# EAGLE schematic micr0x (EAGLE 9.2.2)

## Sheet 1 of 2
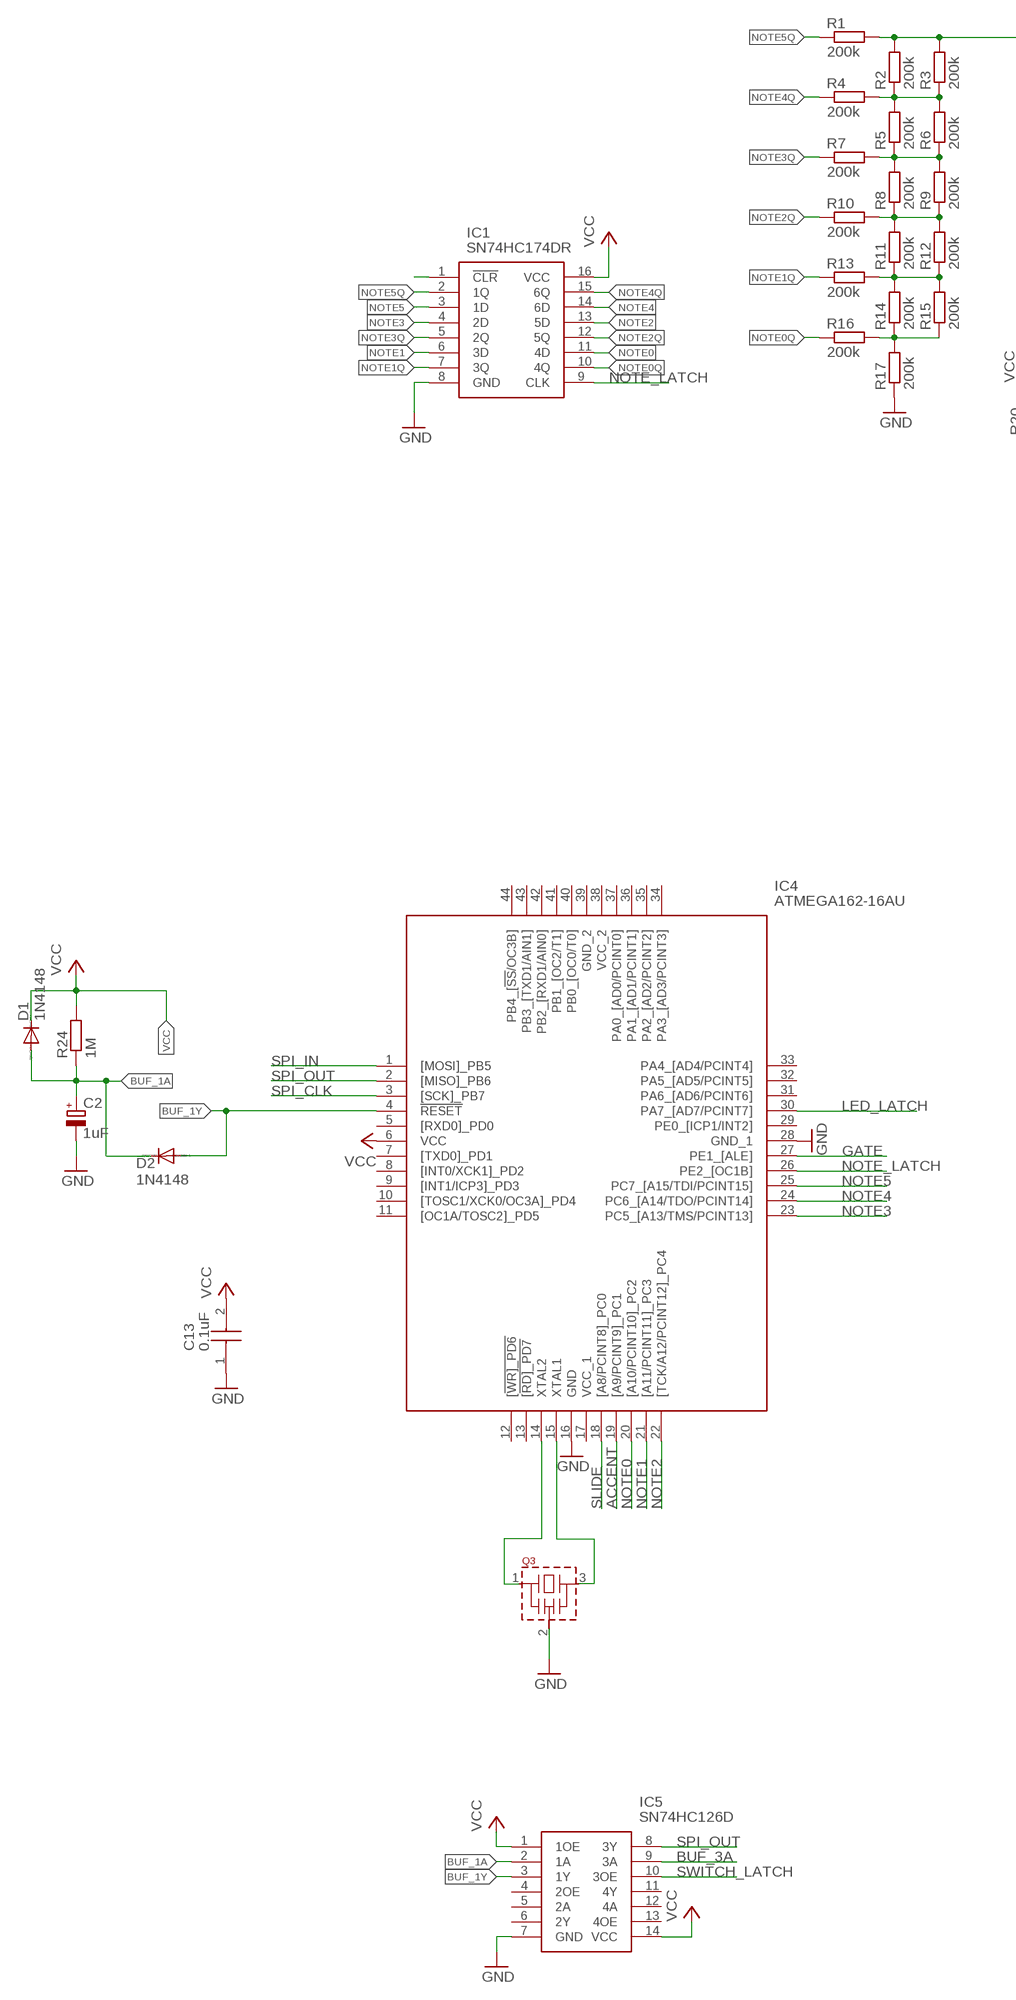
[diagram p0: schematic, sheet 1, part 1 of 2]
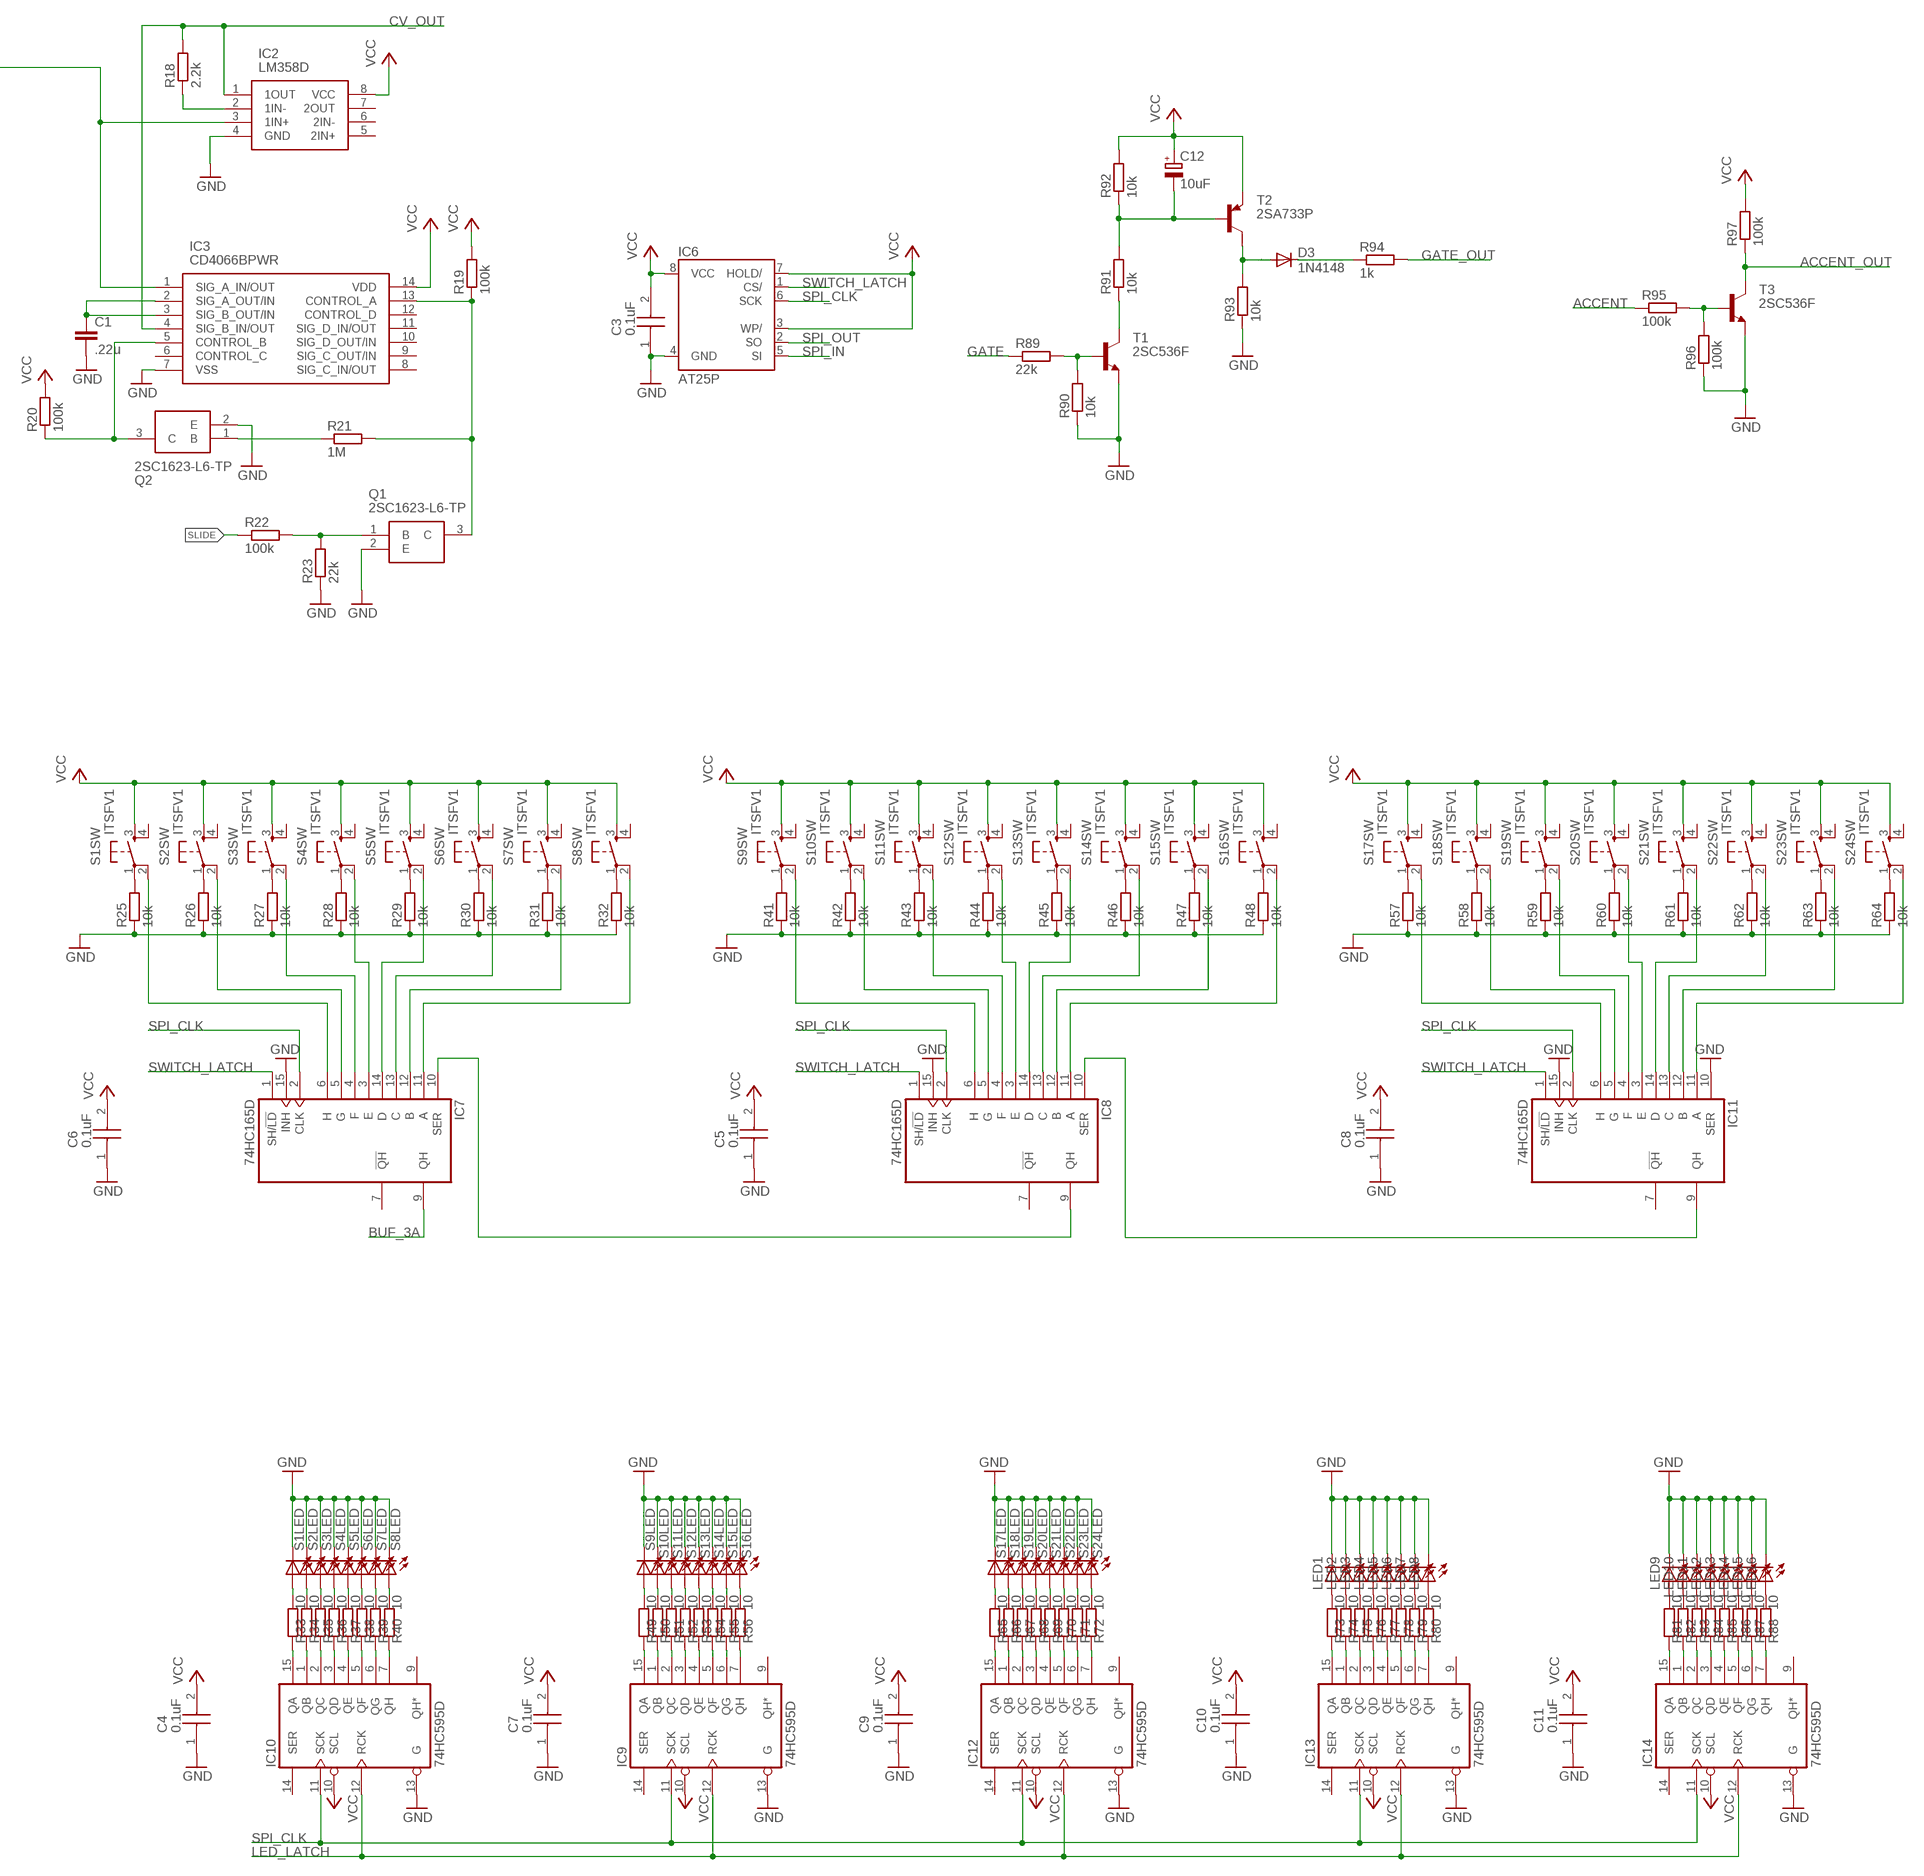
[diagram p1: schematic, sheet 1, part 2 of 2]

### Parts
C1  .22u  C-EU075-032X103  [C075-032X103]
C2  1uF  CPOL-EUE2-5  [E2-5]
C3  0.1uF  GCJ188R71H104KA12D  [CAPC1608X90N]
C4  0.1uF  GCJ188R71H104KA12D  [CAPC1608X90N]
C5  0.1uF  GCJ188R71H104KA12D  [CAPC1608X90N]
C6  0.1uF  GCJ188R71H104KA12D  [CAPC1608X90N]
C7  0.1uF  GCJ188R71H104KA12D  [CAPC1608X90N]
C8  0.1uF  GCJ188R71H104KA12D  [CAPC1608X90N]
C9  0.1uF  GCJ188R71H104KA12D  [CAPC1608X90N]
C10  0.1uF  GCJ188R71H104KA12D  [CAPC1608X90N]
C11  0.1uF  GCJ188R71H104KA12D  [CAPC1608X90N]
C12  10uF  CPOL-EUE2-5  [E2-5]
C13  0.1uF  GCJ188R71H104KA12D  [CAPC1608X90N]
D1  1N4148  1N4148DO35-7  [DO35-7]
D2  1N4148  1N4148DO35-7  [DO35-7]
D3  1N4148  1N4148DO35-7  [DO35-7]
IC1  SN74HC174DR  [SOIC127P600X175-16N]
IC2  LM358D  [SOIC127P600X175-8N]
IC3  CD4066BPWR  [SOP65P640X120-14N]
IC4  ATMEGA162-16AU  [QFP80P1200X1200X120-44N]
IC5  SN74HC126D  [SOIC127P600X175-14N]
IC6  AT25P  [DIL08]
IC7  74HC165D  [SO16]
IC8  74HC165D  [SO16]
IC9  74HC595D  [SO16]
IC10  74HC595D  [SO16]
IC11  74HC165D  [SO16]
IC12  74HC595D  [SO16]
IC13  74HC595D  [SO16]
IC14  74HC595D  [SO16]
LED1  LED3MM  [LED3MM]
LED2  LED3MM  [LED3MM]
LED3  LED3MM  [LED3MM]
LED4  LED3MM  [LED3MM]
LED5  LED3MM  [LED3MM]
LED6  LED3MM  [LED3MM]
LED7  LED3MM  [LED3MM]
LED8  LED3MM  [LED3MM]
LED9  LED3MM  [LED3MM]
LED10  LED3MM  [LED3MM]
LED11  LED3MM  [LED3MM]
LED12  LED3MM  [LED3MM]
LED13  LED3MM  [LED3MM]
LED14  LED3MM  [LED3MM]
LED15  LED3MM  [LED3MM]
LED16  LED3MM  [LED3MM]
Q1  2SC1623-L6-TP  [SOT96P237X112-3N]
Q2  2SC1623-L6-TP  [SOT96P237X112-3N]
Q3  CSTLS_X  [CSTLS_X]
R1  200k  R-EU_R0603  [R0603]
R2  200k  R-EU_R0603  [R0603]
R3  200k  R-EU_R0603  [R0603]
R4  200k  R-EU_R0603  [R0603]
R5  200k  R-EU_R0603  [R0603]
R6  200k  R-EU_R0603  [R0603]
R7  200k  R-EU_R0603  [R0603]
R8  200k  R-EU_R0603  [R0603]
R9  200k  R-EU_R0603  [R0603]
R10  200k  R-EU_R0603  [R0603]
R11  200k  R-EU_R0603  [R0603]
R12  200k  R-EU_R0603  [R0603]
R13  200k  R-EU_R0603  [R0603]
R14  200k  R-EU_R0603  [R0603]
R15  200k  R-EU_R0603  [R0603]
R16  200k  R-EU_R0603  [R0603]
R17  200k  R-EU_R0603  [R0603]
R18  2.2k  R-EU_R0603  [R0603]
R19  100k  R-EU_R0603  [R0603]
R20  100k  R-EU_R0603  [R0603]
R21  1M  R-EU_R0603  [R0603]
R22  100k  R-EU_R0603  [R0603]
R23  22k  R-EU_R0603  [R0603]
R24  1M  R-EU_R0603  [R0603]
R25  10k  R-EU_R0603  [R0603]
R26  10k  R-EU_R0603  [R0603]
R27  10k  R-EU_R0603  [R0603]
R28  10k  R-EU_R0603  [R0603]
R29  10k  R-EU_R0603  [R0603]
R30  10k  R-EU_R0603  [R0603]
R31  10k  R-EU_R0603  [R0603]
R32  10k  R-EU_R0603  [R0603]
R33  10  R-EU_R0603  [R0603]
R34  10  R-EU_R0603  [R0603]
R35  10  R-EU_R0603  [R0603]
R36  10  R-EU_R0603  [R0603]
R37  10  R-EU_R0603  [R0603]
R38  10  R-EU_R0603  [R0603]
R39  10  R-EU_R0603  [R0603]
R40  10  R-EU_R0603  [R0603]
R41  10k  R-EU_R0603  [R0603]
R42  10k  R-EU_R0603  [R0603]
R43  10k  R-EU_R0603  [R0603]
R44  10k  R-EU_R0603  [R0603]
R45  10k  R-EU_R0603  [R0603]
R46  10k  R-EU_R0603  [R0603]
R47  10k  R-EU_R0603  [R0603]
R48  10k  R-EU_R0603  [R0603]
R49  10  R-EU_R0603  [R0603]
R50  10  R-EU_R0603  [R0603]
R51  10  R-EU_R0603  [R0603]
R52  10  R-EU_R0603  [R0603]
R53  10  R-EU_R0603  [R0603]
R54  10  R-EU_R0603  [R0603]
R55  10  R-EU_R0603  [R0603]
R56  10  R-EU_R0603  [R0603]
R57  10k  R-EU_R0603  [R0603]
R58  10k  R-EU_R0603  [R0603]
R59  10k  R-EU_R0603  [R0603]
R60  10k  R-EU_R0603  [R0603]
R61  10k  R-EU_R0603  [R0603]
R62  10k  R-EU_R0603  [R0603]
R63  10k  R-EU_R0603  [R0603]
R64  10k  R-EU_R0603  [R0603]
R65  10  R-EU_R0603  [R0603]
R66  10  R-EU_R0603  [R0603]
R67  10  R-EU_R0603  [R0603]
R68  10  R-EU_R0603  [R0603]
R69  10  R-EU_R0603  [R0603]
R70  10  R-EU_R0603  [R0603]
R71  10  R-EU_R0603  [R0603]
R72  10  R-EU_R0603  [R0603]
R73  10  R-EU_R0603  [R0603]
R74  10  R-EU_R0603  [R0603]
R75  10  R-EU_R0603  [R0603]
R76  10  R-EU_R0603  [R0603]
R77  10  R-EU_R0603  [R0603]
R78  10  R-EU_R0603  [R0603]
R79  10  R-EU_R0603  [R0603]
R80  10  R-EU_R0603  [R0603]
R81  10  R-EU_R0603  [R0603]
R82  10  R-EU_R0603  [R0603]
R83  10  R-EU_R0603  [R0603]
R84  10  R-EU_R0603  [R0603]
R85  10  R-EU_R0603  [R0603]
R86  10  R-EU_R0603  [R0603]
R87  10  R-EU_R0603  [R0603]
R88  10  R-EU_R0603  [R0603]
R89  22k  R-EU_R0603  [R0603]
R90  10k  R-EU_R0603  [R0603]
R91  10k  R-EU_R0603  [R0603]
R92  10k  R-EU_R0603  [R0603]
R93  10k  R-EU_R0603  [R0603]
R94  1k  R-EU_R0603  [R0603]
R95  100k  R-EU_R0603  [R0603]
R96  100k  R-EU_R0603  [R0603]
R97  100k  R-EU_R0603  [R0603]
S1  ITSFV1  [ITSFV1]
S2  ITSFV1  [ITSFV1]
S3  ITSFV1  [ITSFV1]
S4  ITSFV1  [ITSFV1]
S5  ITSFV1  [ITSFV1]
S6  ITSFV1  [ITSFV1]
S7  ITSFV1  [ITSFV1]
S8  ITSFV1  [ITSFV1]
S9  ITSFV1  [ITSFV1]
S10  ITSFV1  [ITSFV1]
S11  ITSFV1  [ITSFV1]
S12  ITSFV1  [ITSFV1]
S13  ITSFV1  [ITSFV1]
S14  ITSFV1  [ITSFV1]
S15  ITSFV1  [ITSFV1]
S16  ITSFV1  [ITSFV1]
S17  ITSFV1  [ITSFV1]
S18  ITSFV1  [ITSFV1]
S19  ITSFV1  [ITSFV1]
S20  ITSFV1  [ITSFV1]
S21  ITSFV1  [ITSFV1]
S22  ITSFV1  [ITSFV1]
S23  ITSFV1  [ITSFV1]
S24  ITSFV1  [ITSFV1]
T1  2SC536F  -NPN-TO92  [TO92]
T2  2SA733P  -PNP-TO92  [TO92]
T3  2SC536F  -NPN-TO92  [TO92]

### Nets
ACCENT: IC4.19([A9/PCINT9]_PC1) R95.1
ACCENT_OUT: R97.1 T3.3(C)
BUF_1A: C2.+ D1.A D2.C IC5.2(1A) R24.1
BUF_1Y: D2.A IC4.4(!RESET) IC5.3(1Y)
BUF_3A: IC5.9(3A) IC7.9(QH)
CV_OUT: IC2.1(1OUT) IC3.4(SIG_B_IN/OUT) R18.2
GATE: IC4.27(PE1_[ALE]) R89.1
GATE_OUT: R94.2
GND: C1.2 C2.- C3.1 C4.1 C5.1 C6.1 C7.1 C8.1 C9.1 C10.1 C11.1 C13.1 IC1.8(GND) IC2.4(GND) IC3.7(VSS) IC4.16(GND) IC4.28(GND_1) IC5.7(GND) IC6.4(GND) IC7.15(INH) IC8.15(INH) IC9.13(G) IC10.13(G) IC11.10(SER) IC11.15(INH) IC12.13(G) IC13.13(G) IC14.13(G) LED1.K(C) LED2.K(C) LED3.K(C) LED4.K(C) LED5.K(C) LED6.K(C) LED7.K(C) LED8.K(C) LED9.K(C) LED10.K(C) LED11.K(C) LED12.K(C) LED13.K(C) LED14.K(C) LED15.K(C) LED16.K(C) Q1.2(E) Q2.2(E) Q3.2(VSS) R17.1 R23.1 R25.1 R26.1 R27.1 R28.1 R29.1 R30.1 R31.1 R32.1 R41.1 R42.1 R43.1 R44.1 R45.1 R46.1 R47.1 R48.1 R57.1 R58.1 R59.1 R60.1 R61.1 R62.1 R63.1 R64.1 R90.1 R93.1 R96.1 S1.L1(LED:L1) S2.L1(LED:L1) S3.L1(LED:L1) S4.L1(LED:L1) S5.L1(LED:L1) S6.L1(LED:L1) S7.L1(LED:L1) S8.L1(LED:L1) S9.L1(LED:L1) S10.L1(LED:L1) S11.L1(LED:L1) S12.L1(LED:L1) S13.L1(LED:L1) S14.L1(LED:L1) S15.L1(LED:L1) S16.L1(LED:L1) S17.L1(LED:L1) S18.L1(LED:L1) S19.L1(LED:L1) S20.L1(LED:L1) S21.L1(LED:L1) S22.L1(LED:L1) S23.L1(LED:L1) S24.L1(LED:L1) T1.1(E) T3.1(E)
LED_LATCH: IC4.30(PA7_[AD7/PCINT7]) IC9.12(RCK) IC10.12(RCK) IC12.12(RCK) IC13.12(RCK) IC14.12(RCK)
N$1: R2.1 R3.1 R4.2 R5.2 R6.2
N$2: IC2.2(1IN-) R18.1
N$3: R5.1 R6.1 R7.2 R8.2 R9.2
N$5: R8.1 R9.1 R10.2 R11.2 R12.2
N$6: C1.1 IC3.2(SIG_A_OUT/IN) IC3.3(SIG_B_OUT/IN)
N$7: R11.1 R12.1 R13.2 R14.2 R15.2
N$8: IC3.13(CONTROL_A) Q1.3(C) R19.1 R21.2
N$9: R14.1 R15.1 R16.2 R17.2
N$10: IC2.3(1IN+) IC3.1(SIG_A_IN/OUT) R1.2 R2.2 R3.2
N$11: Q2.1(B) R21.1
N$12: IC3.5(CONTROL_B) Q2.3(C) R20.1
N$14: IC1.1(!CLR)
N$15: Q1.1(B) R22.2 R23.2
N$16: IC4.14(XTAL2) Q3.1
N$17: IC4.15(XTAL1) Q3.3
N$18: IC7.6(H) S1.2
N$19: IC7.5(G) S2.2
N$20: IC7.4(F) S3.2
N$21: IC7.3(E) S4.2
N$22: IC7.11(A) S8.2
N$23: IC7.12(B) S7.2
N$24: IC7.13(C) S6.2
N$25: IC7.14(D) S5.2
N$26: R25.2 S1.1
N$27: R26.2 S2.1
N$28: R27.2 S3.1
N$29: R28.2 S4.1
N$30: R29.2 S5.1
N$31: R30.2 S6.1
N$32: R31.2 S7.1
N$33: R32.2 S8.1
N$34: R33.2 S1.L2(LED:L2)
N$35: R34.2 S2.L2(LED:L2)
N$36: R35.2 S3.L2(LED:L2)
N$37: R36.2 S4.L2(LED:L2)
N$38: R37.2 S5.L2(LED:L2)
N$39: R38.2 S6.L2(LED:L2)
N$40: R39.2 S7.L2(LED:L2)
N$41: R40.2 S8.L2(LED:L2)
N$42: IC10.7(QH) R40.1
N$43: IC10.6(QG) R39.1
N$44: IC10.5(QF) R38.1
N$45: IC10.4(QE) R37.1
N$46: IC10.3(QD) R36.1
N$47: IC10.2(QC) R35.1
N$48: IC10.1(QB) R34.1
N$49: IC10.15(QA) R33.1
N$50: IC8.6(H) S9.2
N$51: IC8.5(G) S10.2
N$52: IC8.4(F) S11.2
N$53: IC8.3(E) S12.2
N$54: IC8.11(A) S16.2
N$55: IC8.12(B) S15.2
N$56: IC8.13(C) S14.2
N$57: IC8.14(D) S13.2
N$58: R41.2 S9.1
N$59: R42.2 S10.1
N$60: R43.2 S11.1
N$61: R44.2 S12.1
N$62: R45.2 S13.1
N$63: R46.2 S14.1
N$64: R47.2 S15.1
N$65: R48.2 S16.1
N$66: IC7.10(SER) IC8.9(QH)
N$67: IC8.10(SER) IC11.9(QH)
N$68: R49.2 S9.L2(LED:L2)
N$69: R50.2 S10.L2(LED:L2)
N$70: R51.2 S11.L2(LED:L2)
N$71: R52.2 S12.L2(LED:L2)
N$72: R53.2 S13.L2(LED:L2)
N$73: R54.2 S14.L2(LED:L2)
N$74: R55.2 S15.L2(LED:L2)
N$75: R56.2 S16.L2(LED:L2)
N$76: IC9.7(QH) R56.1
N$77: IC9.6(QG) R55.1
N$78: IC9.5(QF) R54.1
N$79: IC9.4(QE) R53.1
N$80: IC9.3(QD) R52.1
N$81: IC9.2(QC) R51.1
N$82: IC9.1(QB) R50.1
N$83: IC9.15(QA) R49.1
N$84: IC11.6(H) S17.2
N$85: IC11.5(G) S18.2
N$86: IC11.4(F) S19.2
N$87: IC11.3(E) S20.2
N$88: IC11.11(A) S24.2
N$89: IC11.12(B) S23.2
N$90: IC11.13(C) S22.2
N$91: IC11.14(D) S21.2
N$92: R57.2 S17.1
N$93: R58.2 S18.1
N$94: R59.2 S19.1
N$95: R60.2 S20.1
N$96: R61.2 S21.1
N$97: R62.2 S22.1
N$98: R63.2 S23.1
N$99: R64.2 S24.1
N$100: IC13.7(QH) R80.1
N$101: R65.2 S17.L2(LED:L2)
N$102: R66.2 S18.L2(LED:L2)
N$103: R67.2 S19.L2(LED:L2)
N$104: R68.2 S20.L2(LED:L2)
N$105: R69.2 S21.L2(LED:L2)
N$106: R70.2 S22.L2(LED:L2)
N$107: R71.2 S23.L2(LED:L2)
N$108: R72.2 S24.L2(LED:L2)
N$109: IC12.7(QH) R72.1
N$110: IC12.6(QG) R71.1
N$111: IC12.5(QF) R70.1
N$112: IC12.4(QE) R69.1
N$113: IC12.3(QD) R68.1
N$114: IC12.2(QC) R67.1
N$115: IC12.1(QB) R66.1
N$116: IC12.15(QA) R65.1
N$117: IC13.6(QG) R79.1
N$118: IC13.5(QF) R78.1
N$119: IC13.4(QE) R77.1
N$120: IC13.3(QD) R76.1
N$121: IC13.2(QC) R75.1
N$122: IC13.1(QB) R74.1
N$123: IC13.15(QA) R73.1
N$124: LED1.A R73.2
N$125: LED2.A R74.2
N$126: LED3.A R75.2
N$127: LED4.A R76.2
N$128: LED5.A R77.2
N$129: LED6.A R78.2
N$130: LED7.A R79.2
N$131: LED8.A R80.2
N$132: IC14.7(QH) R88.1
N$133: IC14.6(QG) R87.1
N$134: IC14.5(QF) R86.1
N$135: IC14.4(QE) R85.1
N$136: IC14.3(QD) R84.1
N$137: IC14.2(QC) R83.1
N$138: IC14.1(QB) R82.1
N$139: IC14.15(QA) R81.1
N$140: LED9.A R81.2
N$141: LED10.A R82.2
N$142: LED11.A R83.2
N$143: LED12.A R84.2
N$144: LED13.A R85.2
N$145: LED14.A R86.2
N$146: LED15.A R87.2
N$147: LED16.A R88.2
N$148: C12.- R91.2 R92.1 T2.2(B)
N$149: R91.1 T1.3(C)
N$150: R89.2 R90.2 T1.2(B)
N$151: D3.A R93.2 T2.3(C)
N$152: D3.C R94.1
N$153: R95.2 R96.2 T3.2(B)
NOTE0: IC1.11(4D) IC4.20([A10/PCINT10]_PC2)
NOTE0Q: IC1.10(4Q) R16.1
NOTE1: IC1.6(3D) IC4.21([A11/PCINT11]_PC3)
NOTE1Q: IC1.7(3Q) R13.1
NOTE2: IC1.13(5D) IC4.22([TCK/A12/PCINT12]_PC4)
NOTE2Q: IC1.12(5Q) R10.1
NOTE3: IC1.4(2D) IC4.23(PC5_[A13/TMS/PCINT13])
NOTE3Q: IC1.5(2Q) R7.1
NOTE4: IC1.14(6D) IC4.24(PC6_[A14/TDO/PCINT14])
NOTE4Q: IC1.15(6Q) R4.1
NOTE5: IC1.3(1D) IC4.25(PC7_[A15/TDI/PCINT15])
NOTE5Q: IC1.2(1Q) R1.1
NOTE_LATCH: IC1.9(CLK) IC4.26(PE2_[OC1B])
SLIDE: IC4.18([A8/PCINT8]_PC0) R22.1
SPI_CLK: IC4.3([SCK]_PB7) IC6.6(SCK) IC7.2(CLK) IC8.2(CLK) IC9.11(SCK) IC10.11(SCK) IC11.2(CLK) IC12.11(SCK) IC13.11(SCK) IC14.11(SCK)
SPI_IN: IC4.1([MOSI]_PB5) IC6.5(SI)
SPI_OUT: IC4.2([MISO]_PB6) IC5.8(3Y) IC6.2(SO)
SWITCH_LATCH: IC5.10(3OE) IC6.1(CS/) IC7.1(SH/!LD) IC8.1(SH/!LD) IC11.1(SH/!LD)
VCC: C3.2 C4.2 C5.2 C6.2 C7.2 C8.2 C9.2 C10.2 C11.2 C12.+ C13.2 D1.C IC1.16(VCC) IC2.8(VCC) IC3.14(VDD) IC4.6(VCC) IC5.1(1OE) IC5.14(VCC) IC6.3(WP/) IC6.7(HOLD/) IC6.8(VCC) IC9.10(SCL) IC10.10(SCL) IC12.10(SCL) IC13.10(SCL) IC14.10(SCL) R19.2 R20.2 R24.2 R92.2 R97.2 S1.3 S2.3 S3.3 S4.3 S5.3 S6.3 S7.3 S8.3 S9.3 S10.3 S11.3 S12.3 S13.3 S14.3 S15.3 S16.3 S17.3 S18.3 S19.3 S20.3 S21.3 S22.3 S23.3 S24.3 T2.1(E)
Unconnected: IC2.5(2IN+) IC2.6(2IN-) IC2.7(2OUT) IC3.6(CONTROL_C) IC3.8(SIG_C_IN/OUT) IC3.9(SIG_C_OUT/IN) IC3.10(SIG_D_OUT/IN) IC3.11(SIG_D_IN/OUT) IC3.12(CONTROL_D) IC4.5([RXD0]_PD0) IC4.7([TXD0]_PD1) IC4.8([INT0/XCK1]_PD2) IC4.9([INT1/ICP3]_PD3) IC4.10([TOSC1/XCK0/OC3A]_PD4) IC4.11([OC1A/TOSC2]_PD5) IC4.12([!WR]_PD6) IC4.13([!RD]_PD7) IC4.29(PE0_[ICP1/INT2]) IC4.31(PA6_[AD6/PCINT6]) IC4.32(PA5_[AD5/PCINT5]) IC4.33(PA4_[AD4/PCINT4]) IC4.34(PA3_[AD3/PCINT3]) IC4.35(PA2_[AD2/PCINT2]) IC4.36(PA1_[AD1/PCINT1]) IC4.37(PA0_[AD0/PCINT0]) IC4.40(PB0_[OC0/T0]) IC4.41(PB1_[OC2/T1]) IC4.42(PB2_[RXD1/AIN0]) IC4.43(PB3_[TXD1/AIN1]) IC4.44(PB4_[!SS!/OC3B]) IC5.4(2OE) IC5.5(2A) IC5.6(2Y) IC5.11(4Y) IC5.12(4A) IC5.13(4OE) IC7.7(!QH) IC8.7(!QH) IC9.9(QH*) IC9.14(SER) IC10.9(QH*) IC10.14(SER) IC11.7(!QH) IC12.9(QH*) IC12.14(SER) IC13.9(QH*) IC13.14(SER) IC14.9(QH*) IC14.14(SER) S1.4 S2.4 S3.4 S4.4 S5.4 S6.4 S7.4 S8.4 S9.4 S10.4 S11.4 S12.4 S13.4 S14.4 S15.4 S16.4 S17.4 S18.4 S19.4 S20.4 S21.4 S22.4 S23.4 S24.4

## Sheet 2 of 2

## Power pins joined to a net without a drawn wire
GND: IC7.8(GND) IC8.8(GND) IC9.8(GND) IC10.8(GND) IC11.8(GND) IC12.8(GND) IC13.8(GND) IC14.8(GND)
GND_2: IC4.39(GND_2)
VCC: IC7.16(VCC) IC8.16(VCC) IC9.16(VCC) IC10.16(VCC) IC11.16(VCC) IC12.16(VCC) IC13.16(VCC) IC14.16(VCC)
VCC_1: IC4.17(VCC_1)
VCC_2: IC4.38(VCC_2)

## Library data of the parts
C1 = rcl:C-EU: CAPACITOR, European symbol; MOUSER_PART_NUMBER: QYX2A224KTP; SPICEPREFIX: C
C2 = rcl:CPOL-EU: POLARIZED CAPACITOR, European symbol; MOUSER_PART_NUMBER: 140-REA1R0M2CBK0511P; SPICEPREFIX: C
C3-C11 C13 = SamacSys_Parts:GCJ188R71H104KA12D: Ceramic Capacitor 0.1uF 50V X7R 0603 Murata 0.1F Multilayer Ceramic Capacitor (MLCC) 50 V dc 10% X7R dielectric GCJ SMT max op. temp. +125C Source: Datasheet <https://componentsearchengine.com/Datasheets/1/GCJ188R71H104KA12D.pdf>; DESCRIPTION: Ceramic Capacitor 0.1uF 50V X7R 0603 Murata 0.1F Multilayer Ceramic Capacitor (MLCC) 50 V dc 10% X7R dielectric GCJ SMT max op. temp. +125C; HEIGHT: 0.9mm; MANUFACTURER_NAME: Murata Electronics; MANUFACTURER_PART_NUMBER: GCJ188R71H104KA12D; MOUSER_PART_NUMBER: 81-GCJ188R71H104KA2D
C12 = rcl:CPOL-EU: POLARIZED CAPACITOR, European symbol; SPICEPREFIX: C
D1-D3 = diode:1N4148: DIODE high speed (Philips)
IC1 = SamacSys_Parts:SN74HC174DR: SN74HC174DRG4, D Type Bus Interface Flip Flop, HC, 2 to 6V 16-Pin SOIC Source: Datasheet <http://www.ti.com/lit/ds/symlink/sn74hc174.pdf>; DESCRIPTION: SN74HC174DRG4, D Type Bus Interface Flip Flop, HC, 2 to 6V 16-Pin SOIC; HEIGHT: 1.75mm; MANUFACTURER_NAME: Texas Instruments; MANUFACTURER_PART_NUMBER: SN74HC174DR; MOUSER_PART_NUMBER: 595-SN74HC174DR
IC2 = SamacSys_Parts:LM358D: LM358D, Dual Operational Amplifier 0.7MHz 5 to 28V, 8-Pin SOIC Source: Datasheet <http://www.ti.com/lit/ds/symlink/lm358.pdf>; DESCRIPTION: LM358D, Dual Operational Amplifier 0.7MHz 5 to 28V, 8-Pin SOIC; HEIGHT: 1.75mm; MANUFACTURER_NAME: Texas Instruments; MANUFACTURER_PART_NUMBER: LM358D; MOUSER_PART_NUMBER: 595-LM358D
IC3 = SamacSys_Parts:CD4066BPWR: CMOS Quad Bilateral Switch Source: Datasheet <http://www.ti.com/lit/gpn/cd4066b>; DESCRIPTION: CMOS Quad Bilateral Switch; HEIGHT: 1.2mm; MANUFACTURER_NAME: Texas Instruments; MANUFACTURER_PART_NUMBER: CD4066BPWR
IC4 = SamacSys_Parts:ATMEGA162-16AU: ATMEGA162-16AU, 8 bit AVR Microcontroller 16MHz 16, 512kB, B Flash, 1kb RAM, SPI 44-Pin TQFP Source: Datasheet <https://componentsearchengine.com/Datasheets/1/ATMEGA162-16AU.pdf>; DESCRIPTION: ATMEGA162-16AU, 8 bit AVR Microcontroller 16MHz 16, 512kB, B Flash, 1kb RAM, SPI 44-Pin TQFP; HEIGHT: 1.2mm; MANUFACTURER_NAME: Microchip; MANUFACTURER_PART_NUMBER: ATMEGA162-16AU; MOUSER_PART_NUMBER: 556-ATMEGA162-16AU
IC5 = SamacSys_Parts:SN74HC126D: Quadruple Bus Buffer Gates With 3-State Outputs Source: Datasheet <http://www.ti.com/lit/gpn/sn74hc126>; DESCRIPTION: Quadruple Bus Buffer Gates With 3-State Outputs; HEIGHT: mm; MANUFACTURER_NAME: Texas Instruments; MANUFACTURER_PART_NUMBER: SN74HC126D; MOUSER_PART_NUMBER: 595-SN74HC126D
IC6 = atmel:AT25*: SPI bus serial EEPROM; MPN: CAT25040LI-G; OC_FARNELL: 1718045; OC_NEWARK: 06R0588
IC7 IC8 IC11 = 74xx-eu:74*165: 8-bit parallel load SHIFT REGISTER
IC9 IC10 IC12-IC14 = 74xx-eu:74*595: 8-bit SHIFT REGISTER, output latch
LED1-LED16 = led:LED: LED OSRAM: - CHIPLED LG R971, LG N971, LY N971, LG Q971, LY Q971, LO R971, LY R971 LH N974, LH R974 LS Q976, LO Q976, LY Q976 LO Q996 - Hyper CHIPLED LW Q18S LB Q993, LB Q99A, LB R99A - SideLED LS A670, LO A670, LY A670, LG A670, LP A670 LB A673, LV A673, LT A673, LW A673 LH A674 LY A675 LS A676, LA A676, LO A676, LY A676, LW A676 LS A679, LY A679, LG A679 - Hyper Micro SIDELED® LS Y876, LA Y876, LO Y876, LY Y876 LT Y87S - SmartLED LW L88C, LW L88S LB L89C, LB L89S, LG L890 LS L89K, LO L89K, LY L89K LS L896, LA L896, LO L896, LY L896 - TOPLED LS T670, LO T670, LY T670, LG T670, LP T670 LSG T670, LSP T670, LSY T670, LOP T670, LYG T670 LG T671, LOG T671, LSG T671 LB T673, LV T673, LT T673, LW T673 LH T674 LS T676, LA T676, LO T676, LY T676, LB T676, LH T676, LSB T676, LW T676 LB T67C, LV T67C, LT T67C, LS T67K, LO T67K, LY T67K, LW E67C LS E67B, LA E67B, LO E67B, LY E67B, LB E67C, LV E67C, LT E67C LW T67C LS T679, LY T679, LG T679 LS T770, LO T770, LY T770, LG T770, LP T770 LB T773, LV T773, LT T773, LW T773 LH T774 LS E675, LA E675, LY E675, LS T675 LS T776, LA T776, LO T776, LY T776, LB T776 LHGB T686 LT T68C, LB T68C - Hyper Mini TOPLED® LB M676 - Mini TOPLED Santana® LG M470 LS M47K, LO M47K, LY M47K Source: http://www.osram.convergy.de LUXEON: - LUMILED® LXK2-PW12-R00, LXK2-PW12-S00, LXK2-PW14-U00, LXK2-PW14-V00 LXK2-PM12-R00, LXK2-PM12-S00, LXK2-PM14-U00 LXK2-PE12-Q00, LXK2-PE12-R00, LXK2-PE12-S00, LXK2-PE14-T00, LXK2-PE14-U00 LXK2-PB12-K00, LXK2-PB12-L00, LXK2-PB12-M00, LXK2-PB14-N00, LXK2-PB14-P00, LXK2-PB14-Q00 LXK2-PR12-L00, LXK2-PR12-M00, LXK2-PR14-Q00, LXK2-PR14-R00 LXK2-PD12-Q00, LXK2-PD12-R00, LXK2-PD12-S00 LXK2-PH12-R00, LXK2-PH12-S00 LXK2-PL12-P00, LXK2-PL12-Q00, LXK2-PL12-R00 Source: www.luxeon.com KINGBRIGHT: KA-3528ASYC Source: www.kingbright.com
Q1 Q2 = SamacSys_Parts:2SC1623-L6-TP: Bipolar Transistors - BJT Small Signal Bipolar Transistors Source: Datasheet <https://mouser.componentsearchengine.com/Datasheets/1/2SC1623-L6-TP.pdf>; DESCRIPTION: Bipolar Transistors - BJT Small Signal Bipolar Transistors; HEIGHT: 1.12mm; MANUFACTURER_NAME: Micro Commercial Components (MCC); MANUFACTURER_PART_NUMBER: 2SC1623-L6-TP
Q3 = murata-resonators:CSTLS_X: Ceramic resonator 16.00 to 70.00 MHz
R1-R17 R33-R40 R49-R56 R65-R88 = rcl:R-EU_: RESISTOR, European symbol; MOUSER_PART_NUMBER: RCS0603200KFKEA; SPICEPREFIX: R
R18 = rcl:R-EU_: RESISTOR, European symbol; MOUSER_PART_NUMBER: RCS06032K20JNEA; SPICEPREFIX: R
R19 R20 R22 = rcl:R-EU_: RESISTOR, European symbol; MOUSER_PART_NUMBER: RCS0603100KJNEA; SPICEPREFIX: R
R21 R24 = rcl:R-EU_: RESISTOR, European symbol; MOUSER_PART_NUMBER: RCS06031M00JNEA; SPICEPREFIX: R
R23 = rcl:R-EU_: RESISTOR, European symbol; MOUSER_PART_NUMBER: RCS060322K0JNEA; SPICEPREFIX: R
R25-R32 R41-R48 R57-R64 R89-R97 = rcl:R-EU_: RESISTOR, European symbol; MOUSER_PART_NUMBER: RCS060310K0JNEA; SPICEPREFIX: R
S1-S24 = its-switch:ITSFV1
T1 T3 = transistor:*-NPN-: NPN Transistror BF959 corrected 2008.03.06
T2 = transistor:*-PNP-: PNP Transistror